# Altium schematic sheet Sheet1.SchDoc: IMU Design
size A4; Author: Matthew Duggan, Alex Philp, Keion Larsen
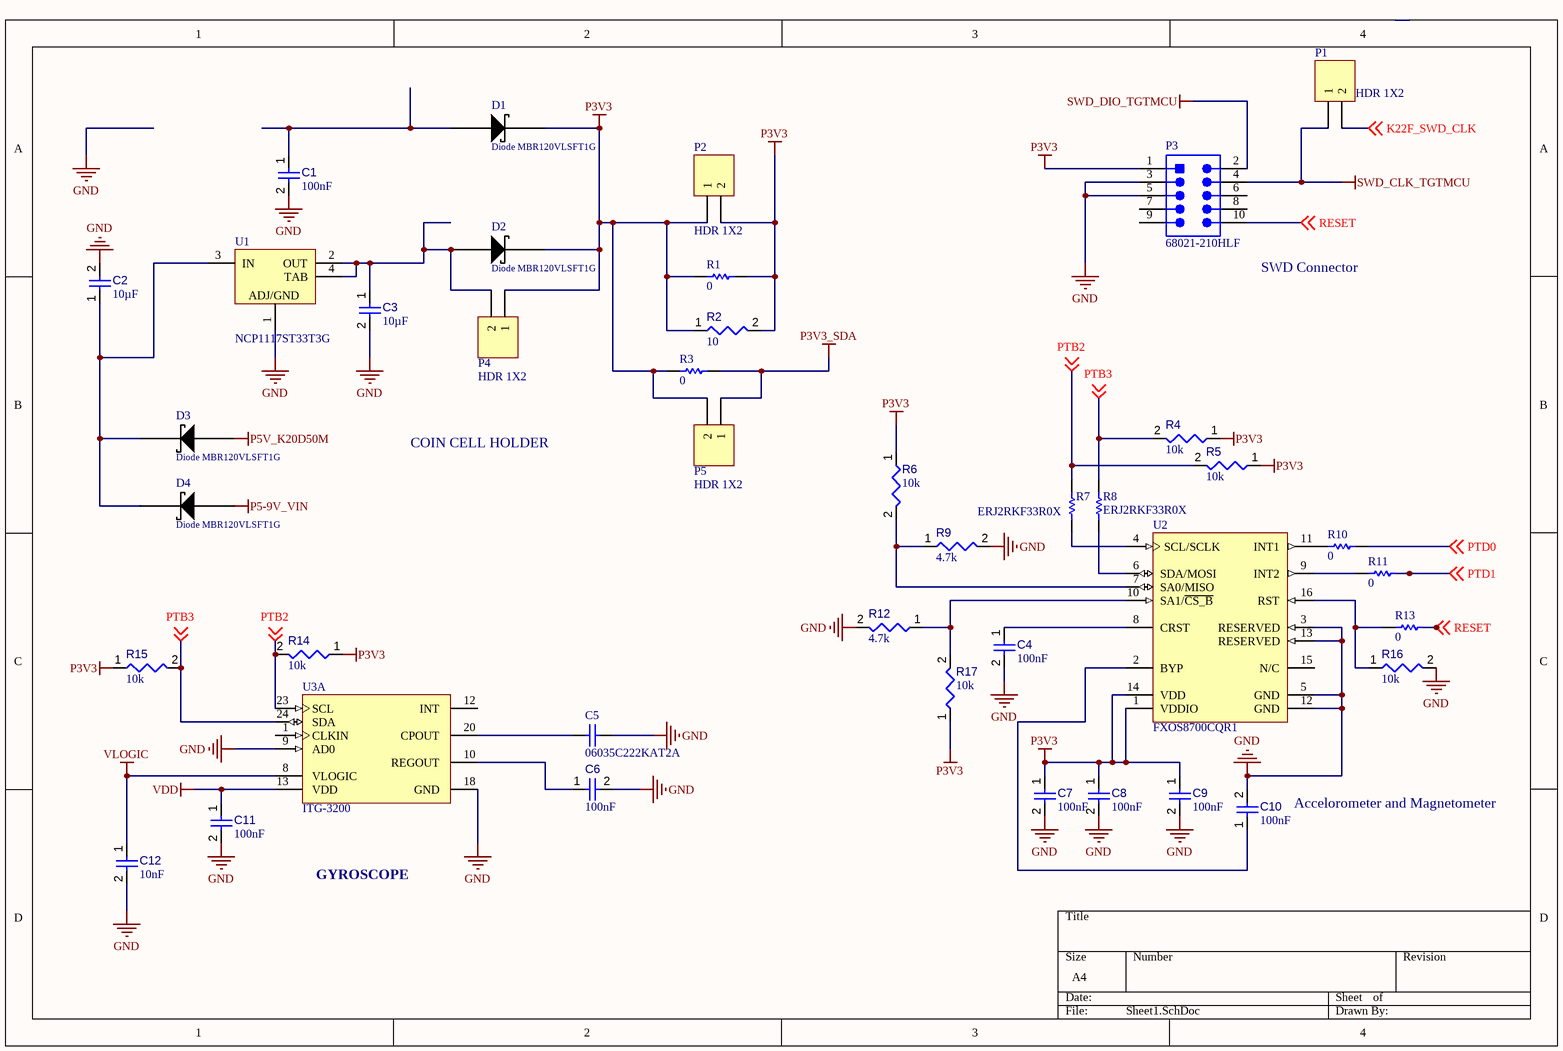
[diagram p0: Sheet1.SchDoc]

## Parts
C1  value 100nF  [CAPC1608X90X40ML10T20]  (hidden comment: Capacitor 100 nF +/-10% 50 V 0603)
C2  value 10µF  [CAPC0402(1005)60_L]  (hidden comment: Capacitor 10µF +/-40% 6.3V 0402)
C3  value 10µF  [CAPC0402(1005)60_L]  (hidden comment: Capacitor 10µF +/-40% 6.3V 0402)
C4  value 100nF  [CAPC1608X90X40ML10T20]  (hidden comment: Capacitor 100 nF +/-10% 50 V 0603)
C5  06035C222KAT2A  [CAPC1608X90X35ML15T15]
C6  value 100nF  [CAPC0402(1005)60_L]  (hidden comment: Capacitor 100nF +/-20% 50V 0402)
C7  value 100nF  [CAPC1608X90X40ML10T20]  (hidden comment: Capacitor 100 nF +/-10% 50 V 0603)
C8  value 100nF  [CAPC1608X90X40ML10T20]  (hidden comment: Capacitor 100 nF +/-10% 50 V 0603)
C9  value 100nF  [CAPC1608X90X40ML10T20]  (hidden comment: Capacitor 100 nF +/-10% 50 V 0603)
C10  value 100nF  [CAPC1608X90X40ML10T20]  (hidden comment: Capacitor 100 nF +/-10% 50 V 0603)
C11  value 100nF  [CAPC0402(1005)60_L]  (hidden comment: Capacitor 100nF +/-20% 50V 0402)
C12  value 10nF  [CAPC0402(1005)60_L]  (hidden comment: Capacitor 10nF +/-20% 50V 0402)
D1  Diode MBR120VLSFT1G  [SODFL360X100-2N]
D2  Diode MBR120VLSFT1G  [SODFL360X100-2N]
D3  Diode MBR120VLSFT1G  [SODFL360X100-2N]
D4  Diode MBR120VLSFT1G  [SODFL360X100-2N]
P1  HDR 1X2  [HDR1X2]
P2  HDR 1X2  [HDR1X2]
P3  68021-210HLF  [FCI-68021-210HLF-10_V]
P4  HDR 1X2  [HDR1X2]
P5  HDR 1X2  [HDR1X2]
R1  value 0  [RESC1005X40X25ML05T05]  (hidden comment: Resistor 0R +/- 5% 0402 100 mW)
R2  value 10  [RESC0402(1005)_L]  (hidden comment: Resistor 10R  +/-1 % 0402 63 mW)
R3  value 0  [RESC1005X40X25ML05T05]  (hidden comment: Resistor 0R +/- 5% 0402 100 mW)
R4  value 10k  [RESC1005X40X25ML05T05]  (hidden comment: Resistor 10k +/-1% 0402 63 mW)
R5  value 10k  [RESC1005X40X25ML05T05]  (hidden comment: Resistor 10k +/-1% 0402 63 mW)
R6  value 10k  [RESC1005X40X25ML05T05]  (hidden comment: Resistor 10k +/-1% 0402 63 mW)
R7  ERJ2RKF33R0X  [RESC1005X40X25LL05T05]
R8  ERJ2RKF33R0X  [RESC1005X40X25LL05T05]
R9  value 4.7k  [RESC1608X55X25ML10T15]  (hidden comment: Resistor 4k7 +/-1% 0603 100 mW)
R10  value 0  [RESC1005X40X25ML05T05]  (hidden comment: Resistor 0R +/- 5% 0402 100 mW)
R11  value 0  [RESC1005X40X25ML05T05]  (hidden comment: Resistor 0R +/- 5% 0402 100 mW)
R12  value 4.7k  [RESC1608X55X25ML10T15]  (hidden comment: Resistor 4k7 +/-1% 0603 100 mW)
R13  value 0  [RESC1005X40X25ML05T05]  (hidden comment: Resistor 0R +/- 5% 0402 100 mW)
R14  value 10k  [RESC1005X40X25ML05T05]  (hidden comment: Resistor 10k +/-1% 0402 63 mW)
R15  value 10k  [RESC1005X40X25ML05T05]  (hidden comment: Resistor 10k +/-1% 0402 63 mW)
R16  value 10k  [RESC1005X40X25ML05T05]  (hidden comment: Resistor 10k +/-1% 0402 63 mW)
R17  value 10k  [RESC1005X40X25ML05T05]  (hidden comment: Resistor 10k +/-1% 0402 63 mW)
U1  NCP1117ST33T3G  [ONSC-SOT-223-4-318H-01_A_V]
U2  FXOS8700CQR1  [FREE-QFN-16-3000X3000DE_V]
U3  ITG-3200  [INSE-QFN-24_A_M]  (part A of 2)

## Nets
GND: C1.2 C2.2 C3.2 C4.2 C5.2 C6.2 C7.2 C8.2 C9.2 C10.2 C11.2 C12.2 P3.3 P3.5 R9.2 R12.2 R16.2 U1.1(ADJ/GND) U2.3(RESERVED) U2.5(GND) U2.12(GND) U2.13(RESERVED) U3.9(AD0) U3.18(GND)
P3V3: C7.1 C8.1 C9.1 D1.1 D2.1 P2.1 P2.2 P3.1 P4.1 P5.2 R1.1 R1.2 R2.1 R2.2 R3.1 R4.1 R5.1 R6.1 R14.1 R15.1 R17.1 U2.1(VDDIO) U2.14(VDD)
P3V3_SDA: P5.1 R3.2
P5-9V_VIN: D4.2
P5V_K20D50M: D3.2
SWD_CLK_TGTMCU: P1.1 P3.4
SWD_DIO_TGTMCU: P3.2
VDD: C11.1 U3.13(VDD)
VLOGIC: C12.1 U3.8(VLOGIC)
K22F_SWD_CLK: P1.2 ; off-sheet K22F_SWD_CLK
PTB2: R5.2 R7.2 R14.2 U3.23(SCL) ; off-sheet PTB2
PTB3: R4.2 R8.2 R15.2 U3.24(SDA) ; off-sheet PTB3
PTD0: R10.2 ; off-sheet PTD0
PTD1: R11.2 ; off-sheet PTD1
RESET: P3.10 R13.2 ; off-sheet RESET
NetC1_1: C1.1 D1.2
NetC2_1: C2.1 D3.1 D4.1 U1.3(IN)
NetC3_1: C3.1 D2.2 P4.2 U1.2(OUT) U1.4(TAB)
NetC4_1: C4.1 U2.8(CRST)
NetC5_1: C5.1 U3.20(CPOUT)
NetC6_1: C6.1 U3.10(REGOUT)
NetC10_1: C10.1 U2.2(BYP)
NetR6_2: R6.2 R9.1 U2.7(SA0/MISO)
NetR7_1: R7.1 U2.4(SCL/SCLK)
NetR8_1: R8.1 U2.6(SDA/MOSI)
NetR10_1: R10.1 U2.11(INT1)
NetR11_1: R11.1 U2.9(INT2)
NetR12_1: R12.1 R17.2 U2.10(SA1/~{CS_B})
NetR13_1: R13.1 R16.1 U2.16(RST)

Not connected (* = marked no-connect by the designer): P3 6 7 8 9; U2 15(N/C); U3 1(CLKIN) 12(INT)

## Notes on the sheet
- SWD Connector
- COIN CELL HOLDER
- (near C10) Accelorometer and Magnetometer
- GYROSCOPE

## Library data of the parts
C1 C4 C7-C10 = CMP-001-00017-4: Chip Capacitor, 100 nF, +/- 10%, 50 V, 0603 (1608 Metric); Capacitor Type: Ceramic; Voltage Rating: 50V; RoHS Compliant: True; Max Operating Temperature: 125°C; Pins: 2; Mounting Technology: SM; Min Operating Temperature: -55°C; Tolerance: 10%; Case/Package: 0603
C2 C3 = CMP-001-00074-2: Chip Capacitor, 10µF +/-40%, 6.3V, 0402, Thickness 0.6 mm; Tolerance: 10%; Max Operating Temperature: 85°C; Pins: 2; Case/Package: 0402; Min Operating Temperature: -55°C; Voltage Rating: 6.3V; Mounting Technology: SMT
C5 = CMP-2006-04409-1: Manufacturer: AVX Interconnect / Elco; Part Number: 06035C222KAT2A
C6 C11 = CMP-001-00067-2: Chip Capacitor, 100nF +/-20%, 50V, 0402, Thickness 0.6 mm; Tolerance: 10%; Mounting Technology: SMT; Min Operating Temperature: -55°C; Pins: 2; Case/Package: 0402; Voltage Rating: 50V; Max Operating Temperature: 85°C
C12 = CMP-001-00069-2: Chip Capacitor, 10nF +/-20%, 50V, 0402, Thickness 0.6 mm; Tolerance: 5%; Voltage Rating: 50V; Pins: 2; Max Operating Temperature: 85°C; Mounting Technology: SMT; Min Operating Temperature: -55°C; Case/Package: 0402
D1-D4 = CMP-007-0001-1: MBR120VLSFT1G Schottky Rectifier, 20V, 1A; Component Type: Standard; Pins: 2; Design Item ID: Diode MBR120VLSFT1G; Source: JCULibrary.SchLib
P1 P2 P4 P5 = Header 2: Header, 2-Pin; LatestRevisionDate: 17-Jul-2002; LatestRevisionNote: Re-released for DXP Platform.; Publisher: Altium Limited
P3 = CMP-002-00020-1: Male Header, Pitch 2.54 mm, 2 x 5 Position, Height 4.83 mm, Tail Length 3.05 mm, Bulk; Manufacturer: FCI Electronics; Package Reference: 68021-210HLF-10; Datasheet URL: http://portal.fciconnect.com/Comergent//fci/drawing/68020.pdf; Gender: Male; Manufacturer URL: http://portal.fciconnect.com/; Mounting Technology: TH; Case/Package: 68021-210HLF-10; RoHS Compliant: Unknown; Package Description: Male Header, Pitch 2.54 mm, 2 x 5 Position, Height 4.83 mm, Tail Length 3.05 mm; Connector Type: Header; Datasheet Version: Rev. BM, 04/2015
R1 R3 R10 R11 R13 = CMP-009-00005-4: Chip Resistor, 0 Ohm, 0.1 W, -55 to 155 degC, 0402 (1005 Metric); Voltage Rating: 50V; Power: 100mW; Max Operating Temperature: 155°C; Tolerance: 5%; RoHS Compliant: True; Pins: 2; Case/Package: 0402; Min Operating Temperature: -55°C; Mounting Technology: SM
R2 = CMP-009-00152-2: Chip Resistor, 10 Ohms, +/-1 %, 63 mW, -55 to 155 degC, 0402; Power: 63mW; Tolerance: 1%; Min Operating Temperature: -55°C; Pins: 2; Max Operating Temperature: 155°C; Case/Package: 0402
R4-R6 R14-R17 = CMP-009-00019-4: Chip Resistor, 10 KOhm, +/- 1%, 63 mW, -55 to 155 degC, 0402 (1005 Metric); Voltage Rating: 50V; Power: 63mW; Case/Package: 0402; Max Operating Temperature: 155°C; Mounting Technology: SM; RoHS Compliant: True; Pins: 2; Min Operating Temperature: -55°C; Tolerance: 1%
R7 R8 = CMP-2002-01146-1: Manufacturer: Panasonic; Part Number: ERJ2RKF33R0X
R9 R12 = CMP-009-00031-4: Chip Resistor, 4.7 KOhm, +/- 1%, 0.1 W, -55 to 155 degC, 0603 (1608 Metric); Power: 100mW; Max Operating Temperature: 155°C; Tolerance: 1%; Mounting Technology: SM; RoHS Compliant: True; Pins: 2; Case/Package: 0603; Min Operating Temperature: -55°C
U1 = CMP-019-00030-2: Low-Dropout Positive Fixed Voltage Regulator, 1 A, 3.3 V Output Voltage, 0 to 125 degC, 4-Pin SOT-223 (318H-01), Pb-Free, Tape and Reel; Manufacturer: ON Semiconductor; Nominal Output Voltage: 3.3V; Min Supply Voltage: 4.75V; Outputs: 1; Max Ouput Current: 1A; Dropout Voltage: 1.1V; Max Supply Voltage: 15V; Max Input Voltage: 20V; Min Input Voltage: 3.5V; Package Description: 4-Pin Small Outline Transistor, Body 6.5 x 3.5 mm, Pitch 2.3 mm; Datasheet Version: Rev. 27, 09/2014; Package Quantity: 4000; Mounting Technology: SM; Datasheet URL: http://www.onsemi.com/pub_link/Collateral/NCP1117-D.PDF; Output Voltage: 3.3V; Manufacturer URL: http://www.onsemi.com/; Output Current: 1A; Min Operating Temperature: 0°C; Package Reference: SOT-223-4-318H-01_A; Max Operating Temperature: 125°C; Pins: 3; Packaging: TapeandReel; Case/Package: SOT-223-4; RoHS Compliant: True
U2 = CMP-2000-05129-1: 6-Axis Xtrinsic Sensor with Integrated Linear Accelerometer and Magnetometer, 1.95 to 3.6 V, -40 to 85 degC, 16-Pin QFN, RoHS, Tape and Reel; Manufacturer: Freescale; Supply Voltage - Min: 1.95V; Operating Supply Voltage: 1.95Vto3.6V; Unit Weight: 0.000808oz; Supply Voltage - Max: 3.6V; Brand: FreescaleSemiconductor; Sensing Axis: X,Y,Z; Output Type: Digital; Package / Case: QFN-16; Datasheet Version: Rev. 1, 06/2012; Factory Pack Quantity: 1000; Mounting Style: SMD/SMT; Datasheet URL: https://datasheet.ciiva.com/12175/fxos8700cq-60595-12175213.pdf; Type: 6AxisSensor; Maximum Operating Temperature: +85C; Manufacturer URL: http://www.nxp.com/; Package Description: 16-Pin Quad Flat No-lead Package, Body 3 x 3 mm, Pitch 0.5 mm; RoHS: Details; Package Reference: QFN-16; Tradename: Xtrinsic; Packaging: Reel; Minimum Operating Temperature: -40C; Product Category: BoardMountAccelerationSensors
U3 = CMP-010-00010-2: Single-Chip, Digital-Output, MEMS Gyroscope, 2.1 to 3.6 V, -40 to 105 degC, 24 -Pin QFN, RoHS, Tape and Reel; Manufacturer: InvenSense; Min Supply Voltage: 2.1V; Interface: Serial; Max Supply Voltage: 3.6V; Pins: 24; Min Operating Temperature: -40°C; Datasheet URL: http://www.farnell.com/datasheets/887152.pdf; RoHS Compliant: True; Mounting Technology: SM; Datasheet Version: Rev. 1.4, 03/2010; Max Operating Temperature: 85°C; Packaging: CutTape; Package Reference: QFN-24_A; Package Description: 24-Pin Quad Flat No-lead Package, Body 4.00 x 4.00 mm, Pitch 0.50 mm, Thermal Pad 3.00 x 2.80 mm; Case/Package: QFN